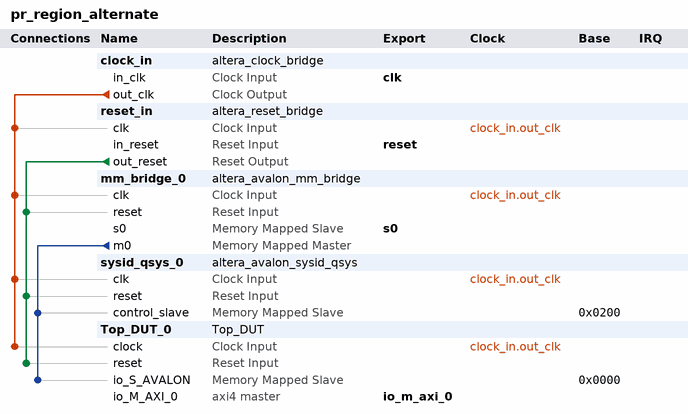
[diagram p0: system contents]
# Platform Designer (Qsys) system pr_region_alternate, Arria 10 10AS066N3F40E2SG
# Parameters at their usual value, and those the tool derives, are not listed.
package require -exact qsys 1.0
create_system pr_region_alternate
set_project_property DEVICE_FAMILY {Arria 10}
set_project_property DEVICE 10AS066N3F40E2SG

add_component clock_in ip/pr_region_alternate/pr_region_alternate_clock_in.ip altera_clock_bridge clock_in 17.1

add_component reset_in ip/pr_region_alternate/pr_region_alternate_reset_in.ip altera_reset_bridge reset_in 17.1

add_component mm_bridge_0 ip/pr_region_alternate/pr_region_alternate_mm_bridge_0.ip altera_avalon_mm_bridge mm_bridge_0 17.1

add_component sysid_qsys_0 ip/pr_region_alternate/pr_region_alternate_sysid_qsys_0.ip altera_avalon_sysid_qsys sysid_qsys_0 17.1

add_component Top_DUT_0 ip/pr_region_alternate/pr_region_alternate_Top_DUT_0.ip Top_DUT Top_DUT_0 1.0

# connections
add_connection clock_in.out_clk mm_bridge_0.clk clock
add_connection clock_in.out_clk reset_in.clk clock
add_connection clock_in.out_clk sysid_qsys_0.clk clock
add_connection clock_in.out_clk Top_DUT_0.clock clock
add_connection reset_in.out_reset mm_bridge_0.reset reset
add_connection reset_in.out_reset sysid_qsys_0.reset reset
add_connection reset_in.out_reset Top_DUT_0.reset reset
add_connection mm_bridge_0.m0 sysid_qsys_0.control_slave avalon
set_connection_parameter_value mm_bridge_0.m0/sysid_qsys_0.control_slave baseAddress 0x0200
add_connection mm_bridge_0.m0 Top_DUT_0.io_S_AVALON avalon
set_connection_parameter_value mm_bridge_0.m0/Top_DUT_0.io_S_AVALON baseAddress 0x0000

# exported interfaces
add_interface clk clock sink
set_interface_property clk EXPORT_OF clock_in.in_clk
add_interface io_m_axi_0 axi4 master
set_interface_property io_m_axi_0 EXPORT_OF Top_DUT_0.io_M_AXI_0
add_interface reset reset sink
set_interface_property reset EXPORT_OF reset_in.in_reset
add_interface s0 avalon slave
set_interface_property s0 EXPORT_OF mm_bridge_0.s0

set_interconnect_requirement {$system} qsys_mm.clockCrossingAdapter HANDSHAKE
set_interconnect_requirement {$system} qsys_mm.enableEccProtection FALSE
set_interconnect_requirement {$system} qsys_mm.insertDefaultSlave FALSE
set_interconnect_requirement {$system} qsys_mm.maxAdditionalLatency 1

save_system pr_region_alternate.qsys
